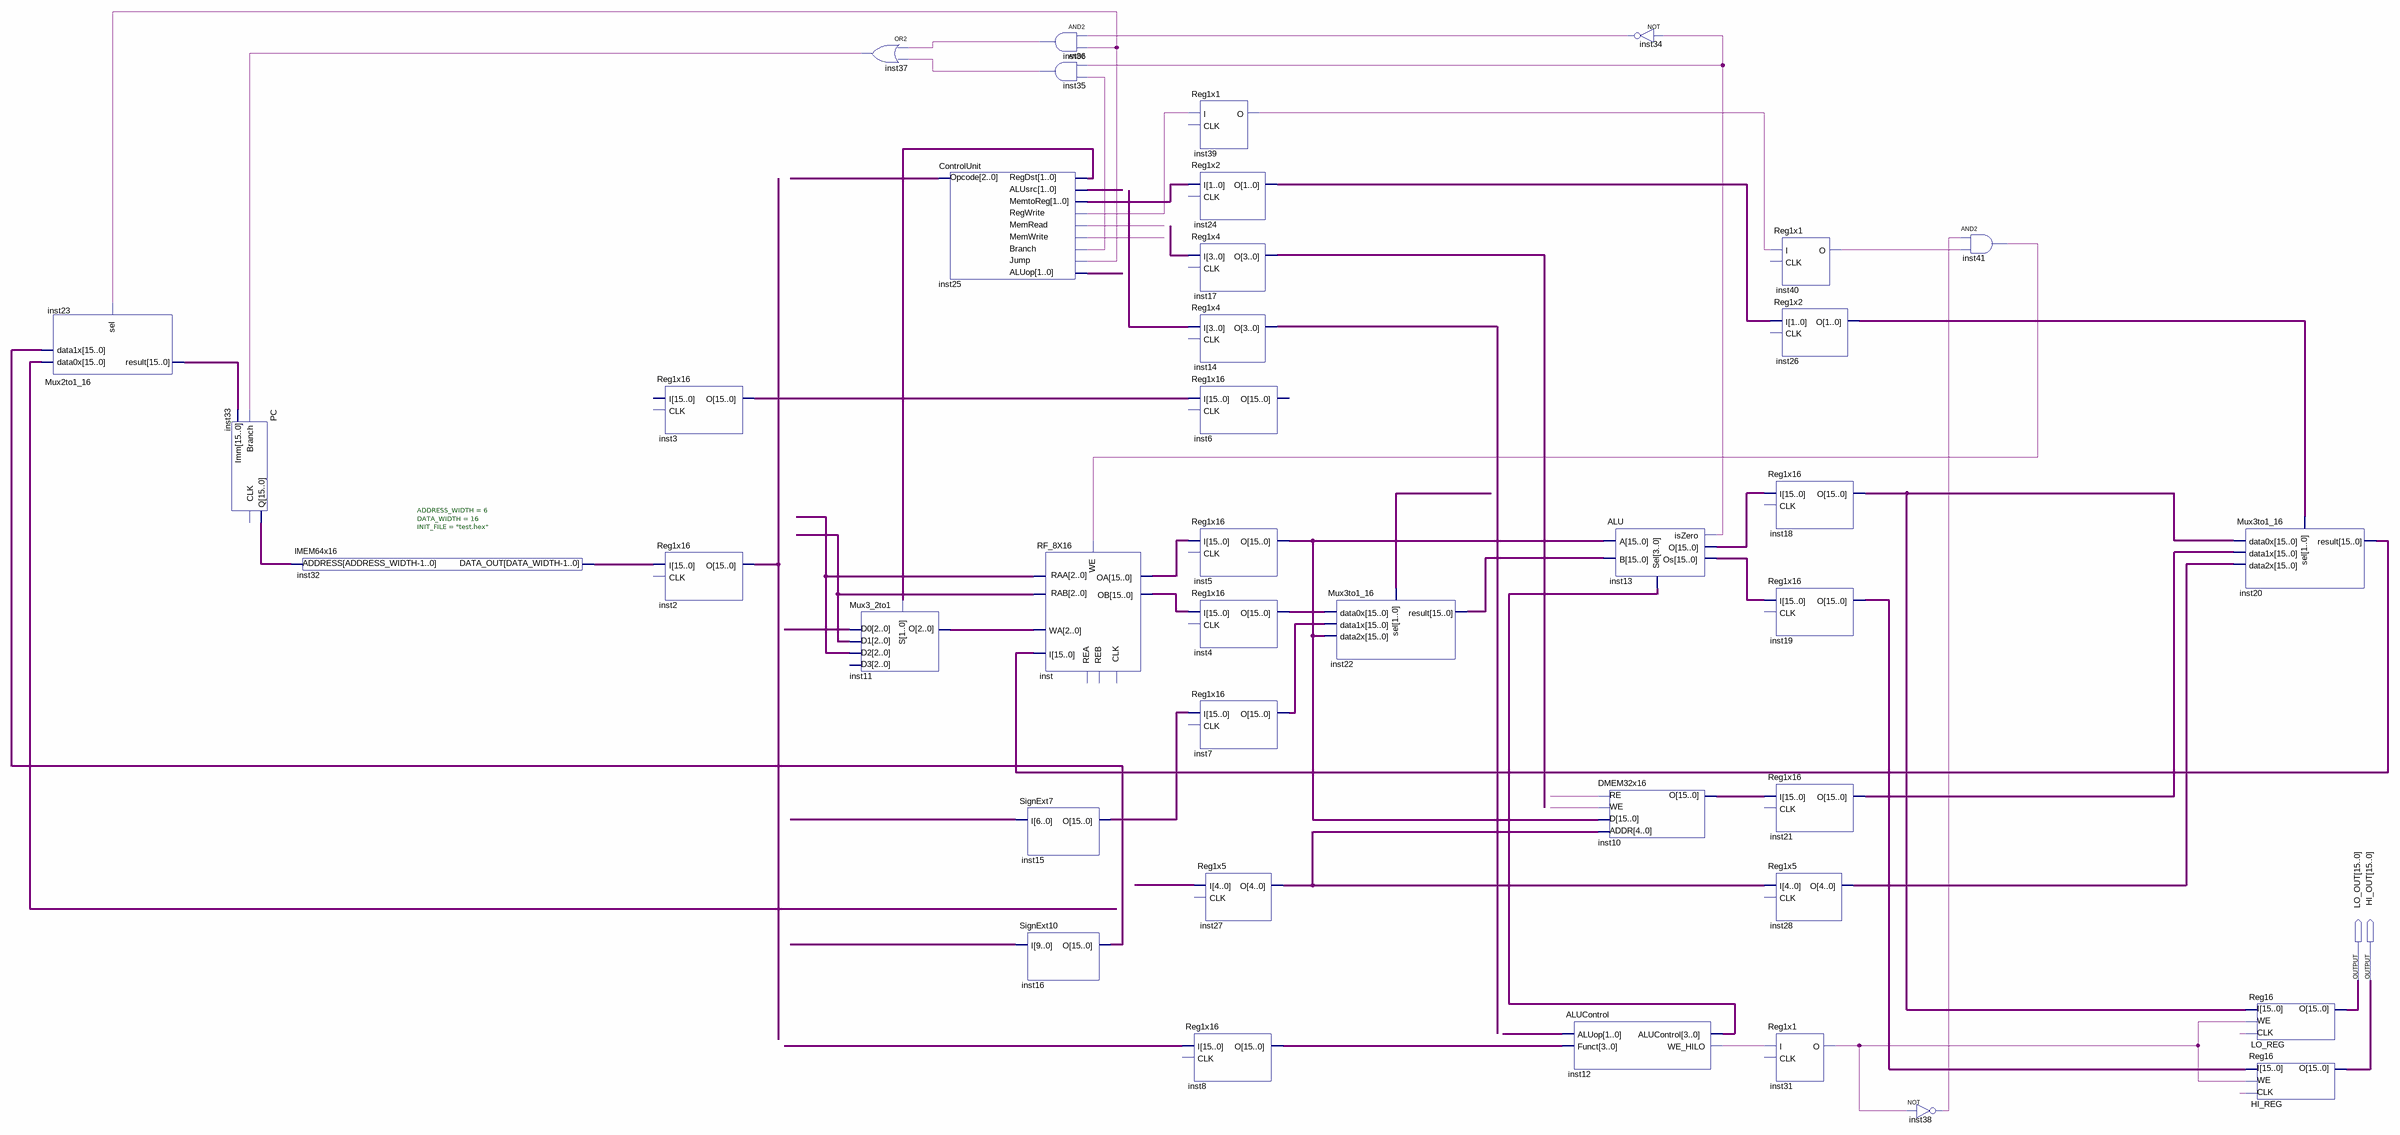
[diagram p0: schematic sheet]
// Quartus schematic Pileline.bdf as structural Verilog: 40 symbols, 2 pins
module Pileline (
  output [15:0] LO_OUT,
  output [15:0] HI_OUT
);

  wire inst12_we_hilo, inst13_iszero, inst25_branch, inst25_jump, inst25_memread, inst25_memwrite,
       inst25_regwrite, inst31_o, inst34_out, inst35_out, inst36_out, inst37_out, inst38_out, inst39_o,
       inst40_o, inst41_out, undriven_8, undriven_9, undriven_13, undriven_14;
  wire [1:0] inst24_o, inst25_aluop, inst25_alusrc, inst25_memtoreg, inst25_regdst, inst26_o, undriven_15,
       undriven_16;
  wire [2:0] inst11_o, undriven, undriven_2, undriven_3, undriven_4;
  wire [3:0] inst12_alucontrol, inst14_o, inst17_o, undriven_10, undriven_11;
  wire [4:0] inst27_o, undriven_12;
  wire [6:0] undriven_5;
  wire [9:0] undriven_6;
  wire [15:0] inst2_o, inst3_o, inst4_o, inst5_o, inst7_o, inst8_o, inst10_o, inst13_o, inst13_os, inst15_o,
       inst16_o, inst18_o, inst19_o, inst20_result, inst21_o, inst22_result, inst23_result, inst28_o,
       inst32_data_out, inst33_q, inst_oa, inst_ob, undriven_7, undriven_17;

  Mux2to1_16 inst23 (.data0x(undriven_17), .data1x(inst16_o), .sel(inst25_jump), .result(inst23_result));
  PC inst33 (.Branch(inst37_out), .Imm(inst23_result), .Q(inst33_q));  // open: CLK
  IMEM64x16 #(.ADDRESS_WIDTH(6), .DATA_WIDTH(16), .INIT_FILE("test.hex")) inst32 (
    .ADDRESS(inst33_q), .DATA_OUT(inst32_data_out));
  Reg1x16 inst3 (.O(inst3_o));  // open: I, CLK
  Reg1x16 inst2 (.I(inst32_data_out), .O(inst2_o));  // open: CLK
  Mux3_2to1 inst11 (.D0(undriven), .D1(undriven_2), .D2(undriven_3), .S(inst25_regdst), .O(inst11_o));  // open: D3
  or inst37 (inst37_out, inst36_out, inst35_out);
  ControlUnit inst25 (
    .Opcode(undriven_4), .RegDst(inst25_regdst), .ALUsrc(inst25_alusrc), .MemtoReg(inst25_memtoreg),
    .RegWrite(inst25_regwrite), .MemRead(inst25_memread), .MemWrite(inst25_memwrite), .Branch(inst25_branch),
    .Jump(inst25_jump), .ALUop(inst25_aluop));
  and inst36 (inst36_out, inst34_out, inst25_jump);
  and inst35 (inst35_out, inst13_iszero, inst25_branch);
  RF_8X16 inst (
    .I(inst20_result), .WA(inst11_o), .WE(inst41_out), .RAA(undriven_3), .RAB(undriven_2), .OB(inst_ob),
    .OA(inst_oa));  // open: REA, REB, CLK
  SignExt7 inst15 (.I(undriven_5), .O(inst15_o));
  SignExt10 inst16 (.I(undriven_6), .O(inst16_o));
  Reg1x1 inst39 (.I(inst25_regwrite), .O(inst39_o));  // open: CLK
  Reg1x2 inst24 (.I(inst25_memtoreg), .O(inst24_o));  // open: CLK
  Reg1x4 inst17 (.I(undriven_11), .O(inst17_o));  // open: CLK
  Reg1x4 inst14 (.I(undriven_10), .O(inst14_o));  // open: CLK
  Reg1x16 inst6 (.I(inst3_o));  // open: CLK, O
  Reg1x16 inst5 (.I(inst_oa), .O(inst5_o));  // open: CLK
  Reg1x16 inst4 (.I(inst_ob), .O(inst4_o));  // open: CLK
  Reg1x16 inst7 (.I(inst15_o), .O(inst7_o));  // open: CLK
  Reg1x16 inst8 (.I(undriven_7), .O(inst8_o));  // open: CLK
  Reg1x5 inst27 (.I(undriven_12), .O(inst27_o));  // open: CLK
  Mux3to1_16 inst22 (.data0x(inst4_o), .data1x(inst7_o), .data2x(inst5_o), .sel(undriven_16), .result(inst22_result));
  ALUControl inst12 (.ALUop(undriven_15), .Funct(inst8_o), .ALUControl(inst12_alucontrol), .WE_HILO(inst12_we_hilo));
  ALU inst13 (
    .Sel(inst12_alucontrol), .A(inst5_o), .B(inst22_result), .O(inst13_o), .Os(inst13_os),
    .isZero(inst13_iszero));
  DMEM32x16 inst10 (.RE(undriven_8), .WE(undriven_9), .D(inst5_o), .ADDR(inst27_o), .O(inst10_o));
  not inst34 (inst34_out, inst13_iszero);
  Reg1x1 inst40 (.I(inst39_o), .O(inst40_o));  // open: CLK
  Reg1x2 inst26 (.I(inst24_o), .O(inst26_o));  // open: CLK
  Reg1x16 inst18 (.I(inst13_o), .O(inst18_o));  // open: CLK
  Reg1x16 inst19 (.I(inst13_os), .O(inst19_o));  // open: CLK
  Reg1x16 inst21 (.I(inst10_o), .O(inst21_o));  // open: CLK
  Reg1x5 inst28 (.I(inst27_o), .O(inst28_o));  // open: CLK
  Reg1x1 inst31 (.I(inst12_we_hilo), .O(inst31_o));  // open: CLK
  not inst38 (inst38_out, inst31_o);
  and inst41 (inst41_out, inst38_out, inst40_o);
  Mux3to1_16 inst20 (.data0x(inst18_o), .data1x(inst21_o), .data2x(inst28_o), .sel(inst26_o), .result(inst20_result));
  Reg16 LO_REG (.WE(inst31_o), .CLK(undriven_13), .I(inst18_o), .O(LO_OUT));
  Reg16 HI_REG (.WE(inst31_o), .CLK(undriven_14), .I(inst19_o), .O(HI_OUT));
endmodule
